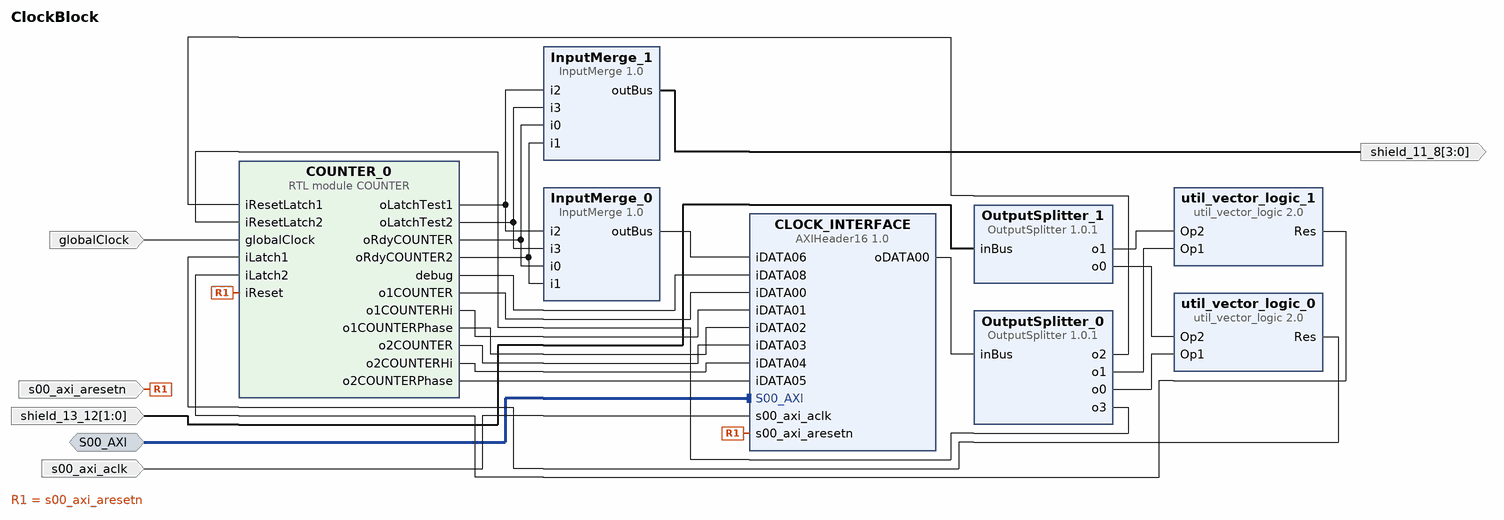
[diagram p0: block diagram of the top level]
# Vivado block design ClockBlock, xc7z007sclg400-1, Vivado 2023.2
create_bd_design ClockBlock

create_bd_intf_port -mode Slave -vlnv xilinx.com:interface:aximm_rtl:1.0 S00_AXI
set_property -dict [list \
  CONFIG.ADDR_WIDTH 31 \
  CONFIG.ARUSER_WIDTH 0 \
  CONFIG.AWUSER_WIDTH 0 \
  CONFIG.BUSER_WIDTH 0 \
  CONFIG.DATA_WIDTH 32 \
  CONFIG.HAS_BRESP 1 \
  CONFIG.HAS_BURST 0 \
  CONFIG.HAS_CACHE 0 \
  CONFIG.HAS_LOCK 0 \
  CONFIG.HAS_PROT 1 \
  CONFIG.HAS_QOS 0 \
  CONFIG.HAS_REGION 0 \
  CONFIG.HAS_RRESP 1 \
  CONFIG.HAS_WSTRB 1 \
  CONFIG.ID_WIDTH 0 \
  CONFIG.MAX_BURST_LENGTH 1 \
  CONFIG.NUM_READ_OUTSTANDING 1 \
  CONFIG.NUM_READ_THREADS 1 \
  CONFIG.NUM_WRITE_OUTSTANDING 1 \
  CONFIG.NUM_WRITE_THREADS 1 \
  CONFIG.PROTOCOL AXI4LITE \
  CONFIG.READ_WRITE_MODE READ_WRITE \
  CONFIG.RUSER_BITS_PER_BYTE 0 \
  CONFIG.RUSER_WIDTH 0 \
  CONFIG.SUPPORTS_NARROW_BURST 0 \
  CONFIG.WUSER_BITS_PER_BYTE 0 \
  CONFIG.WUSER_WIDTH 0 \
] [get_bd_intf_ports S00_AXI]
create_bd_port -dir I globalClock
create_bd_port -dir I -type clk s00_axi_aclk
set_property -dict [list \
  CONFIG.ASSOCIATED_BUSIF S00_AXI \
  CONFIG.ASSOCIATED_RESET s00_axi_aresetn \
  CONFIG.FREQ_TOLERANCE_HZ -1 \
] [get_bd_ports s00_axi_aclk]
create_bd_port -dir I -type rst s00_axi_aresetn
create_bd_port -dir O -from 3 -to 0 shield_11_8
create_bd_port -dir I -from 1 -to 0 shield_13_12

create_bd_cell -type ip -vlnv d3x0r:user:AXIHeader16:1.0 CLOCK_INTERFACE
set_property -dict {CONFIG.INPUTS 9 CONFIG.OUTPUTS 1} [get_bd_cells CLOCK_INTERFACE]
create_bd_cell -type module -reference COUNTER COUNTER_0
create_bd_cell -type ip -vlnv d3x0r:user:InputMerge:1.0 InputMerge_0
set_property -dict [list \
  CONFIG.inWidth4 0 \
  CONFIG.inWidth5 0 \
  CONFIG.inWidth6 0 \
  CONFIG.inWidth7 0 \
  CONFIG.inWidth8 0 \
  CONFIG.inWidth9 0 \
  CONFIG.inWidth10 0 \
  CONFIG.inWidth11 0 \
  CONFIG.inWidth12 0 \
  CONFIG.inWidth13 0 \
  CONFIG.inWidth14 0 \
  CONFIG.inWidth15 0 \
  CONFIG.inWidth16 0 \
  CONFIG.inWidth17 0 \
  CONFIG.inWidth18 0 \
  CONFIG.inWidth19 0 \
  CONFIG.inWidth20 0 \
  CONFIG.inWidth21 0 \
  CONFIG.inWidth22 0 \
  CONFIG.inWidth23 0 \
  CONFIG.inWidth24 0 \
  CONFIG.inWidth25 0 \
  CONFIG.inWidth26 0 \
  CONFIG.inWidth27 0 \
  CONFIG.inWidth28 0 \
  CONFIG.inWidth29 0 \
  CONFIG.inWidth30 0 \
  CONFIG.inWidth31 0 \
] [get_bd_cells InputMerge_0]
create_bd_cell -type ip -vlnv d3x0r:user:InputMerge:1.0 InputMerge_1
set_property -dict [list \
  CONFIG.inWidth4 0 \
  CONFIG.inWidth5 0 \
  CONFIG.inWidth6 0 \
  CONFIG.inWidth7 0 \
  CONFIG.inWidth8 0 \
  CONFIG.inWidth9 0 \
  CONFIG.inWidth10 0 \
  CONFIG.inWidth11 0 \
  CONFIG.inWidth12 0 \
  CONFIG.inWidth13 0 \
  CONFIG.inWidth14 0 \
  CONFIG.inWidth15 0 \
  CONFIG.inWidth16 0 \
  CONFIG.inWidth17 0 \
  CONFIG.inWidth18 0 \
  CONFIG.inWidth19 0 \
  CONFIG.inWidth20 0 \
  CONFIG.inWidth21 0 \
  CONFIG.inWidth22 0 \
  CONFIG.inWidth23 0 \
  CONFIG.inWidth24 0 \
  CONFIG.inWidth25 0 \
  CONFIG.inWidth26 0 \
  CONFIG.inWidth27 0 \
  CONFIG.inWidth28 0 \
  CONFIG.inWidth29 0 \
  CONFIG.inWidth30 0 \
  CONFIG.inWidth31 0 \
  CONFIG.outWidth 4 \
] [get_bd_cells InputMerge_1]
create_bd_cell -type ip -vlnv d3x0r:user:OutputSplitter:1.0.1 OutputSplitter_0
set_property -dict [list \
  CONFIG.enable04 false \
  CONFIG.enable05 false \
  CONFIG.enable06 false \
  CONFIG.enable07 false \
  CONFIG.enable08 false \
  CONFIG.enable09 false \
  CONFIG.enable10 false \
  CONFIG.enable11 false \
  CONFIG.enable12 false \
  CONFIG.enable13 false \
  CONFIG.enable14 false \
  CONFIG.enable15 false \
  CONFIG.enable16 false \
  CONFIG.enable17 false \
  CONFIG.enable18 false \
  CONFIG.enable19 false \
  CONFIG.enable20 false \
  CONFIG.enable21 false \
  CONFIG.enable22 false \
  CONFIG.enable23 false \
  CONFIG.enable24 false \
  CONFIG.enable25 false \
  CONFIG.enable26 false \
  CONFIG.enable27 false \
  CONFIG.enable28 false \
  CONFIG.enable29 false \
  CONFIG.enable30 false \
  CONFIG.enable31 false \
  CONFIG.inWidth 32 \
] [get_bd_cells OutputSplitter_0]
create_bd_cell -type ip -vlnv d3x0r:user:OutputSplitter:1.0.1 OutputSplitter_1
set_property -dict {CONFIG.inWidth 2} [get_bd_cells OutputSplitter_1]
create_bd_cell -type ip -vlnv xilinx.com:ip:util_vector_logic:2.0 util_vector_logic_0
set_property -dict {CONFIG.C_OPERATION or CONFIG.C_SIZE 1} [get_bd_cells util_vector_logic_0]
create_bd_cell -type ip -vlnv xilinx.com:ip:util_vector_logic:2.0 util_vector_logic_1
set_property -dict {CONFIG.C_OPERATION or CONFIG.C_SIZE 1} [get_bd_cells util_vector_logic_1]

# ---- connections ----

connect_bd_intf_net [get_bd_intf_pins CLOCK_INTERFACE/S00_AXI] [get_bd_intf_ports S00_AXI]
connect_bd_net -net AXIHeader16_0_oDATA00 [get_bd_pins CLOCK_INTERFACE/oDATA00] [get_bd_pins OutputSplitter_0/inBus]
connect_bd_net [get_bd_pins COUNTER_0/debug] [get_bd_pins CLOCK_INTERFACE/iDATA08]
connect_bd_net [get_bd_pins COUNTER_0/o1COUNTER] [get_bd_pins CLOCK_INTERFACE/iDATA00]
connect_bd_net [get_bd_pins COUNTER_0/o1COUNTERHi] [get_bd_pins CLOCK_INTERFACE/iDATA01]
connect_bd_net [get_bd_pins COUNTER_0/o1COUNTERPhase] [get_bd_pins CLOCK_INTERFACE/iDATA02]
connect_bd_net [get_bd_pins COUNTER_0/o2COUNTER] [get_bd_pins CLOCK_INTERFACE/iDATA03]
connect_bd_net [get_bd_pins COUNTER_0/o2COUNTERHi] [get_bd_pins CLOCK_INTERFACE/iDATA04]
connect_bd_net [get_bd_pins COUNTER_0/o2COUNTERPhase] [get_bd_pins CLOCK_INTERFACE/iDATA05]
connect_bd_net [get_bd_pins COUNTER_0/oLatchTest1] [get_bd_pins InputMerge_0/i2] [get_bd_pins InputMerge_1/i2]
connect_bd_net [get_bd_pins COUNTER_0/oLatchTest2] [get_bd_pins InputMerge_0/i3] [get_bd_pins InputMerge_1/i3]
connect_bd_net [get_bd_pins COUNTER_0/oRdyCOUNTER] [get_bd_pins InputMerge_0/i0] [get_bd_pins InputMerge_1/i0]
connect_bd_net [get_bd_pins COUNTER_0/oRdyCOUNTER2] [get_bd_pins InputMerge_0/i1] [get_bd_pins InputMerge_1/i1]
connect_bd_net [get_bd_pins InputMerge_0/outBus] [get_bd_pins CLOCK_INTERFACE/iDATA06]
connect_bd_net [get_bd_pins InputMerge_1/outBus] [get_bd_ports shield_11_8]
connect_bd_net [get_bd_pins OutputSplitter_0/o0] [get_bd_pins util_vector_logic_0/Op1]
connect_bd_net [get_bd_pins OutputSplitter_0/o1] [get_bd_pins util_vector_logic_1/Op1]
connect_bd_net [get_bd_pins OutputSplitter_0/o2] [get_bd_pins COUNTER_0/iResetLatch1]
connect_bd_net [get_bd_pins OutputSplitter_0/o3] [get_bd_pins COUNTER_0/iResetLatch2]
connect_bd_net [get_bd_pins OutputSplitter_1/o0] [get_bd_pins util_vector_logic_0/Op2]
connect_bd_net [get_bd_pins OutputSplitter_1/o1] [get_bd_pins util_vector_logic_1/Op2]
connect_bd_net [get_bd_ports globalClock] [get_bd_pins COUNTER_0/globalClock]
connect_bd_net [get_bd_ports s00_axi_aclk] [get_bd_pins CLOCK_INTERFACE/s00_axi_aclk]
connect_bd_net [get_bd_ports s00_axi_aresetn] [get_bd_pins CLOCK_INTERFACE/s00_axi_aresetn] [get_bd_pins COUNTER_0/iReset]
connect_bd_net -net shield_13_12_1 [get_bd_ports shield_13_12] [get_bd_pins OutputSplitter_1/inBus]
connect_bd_net [get_bd_pins util_vector_logic_0/Res] [get_bd_pins COUNTER_0/iLatch1]
connect_bd_net [get_bd_pins util_vector_logic_1/Res] [get_bd_pins COUNTER_0/iLatch2]

# ---- address map ----
assign_bd_address -offset 0x43C00000 -range 64K -target_address_space [get_bd_addr_spaces S00_AXI] [get_bd_addr_segs CLOCK_INTERFACE/S00_AXI/S00_AXI_reg]

validate_bd_design
save_bd_design
